# Altium schematic sheet NewChip.SchDoc
size Tabloid
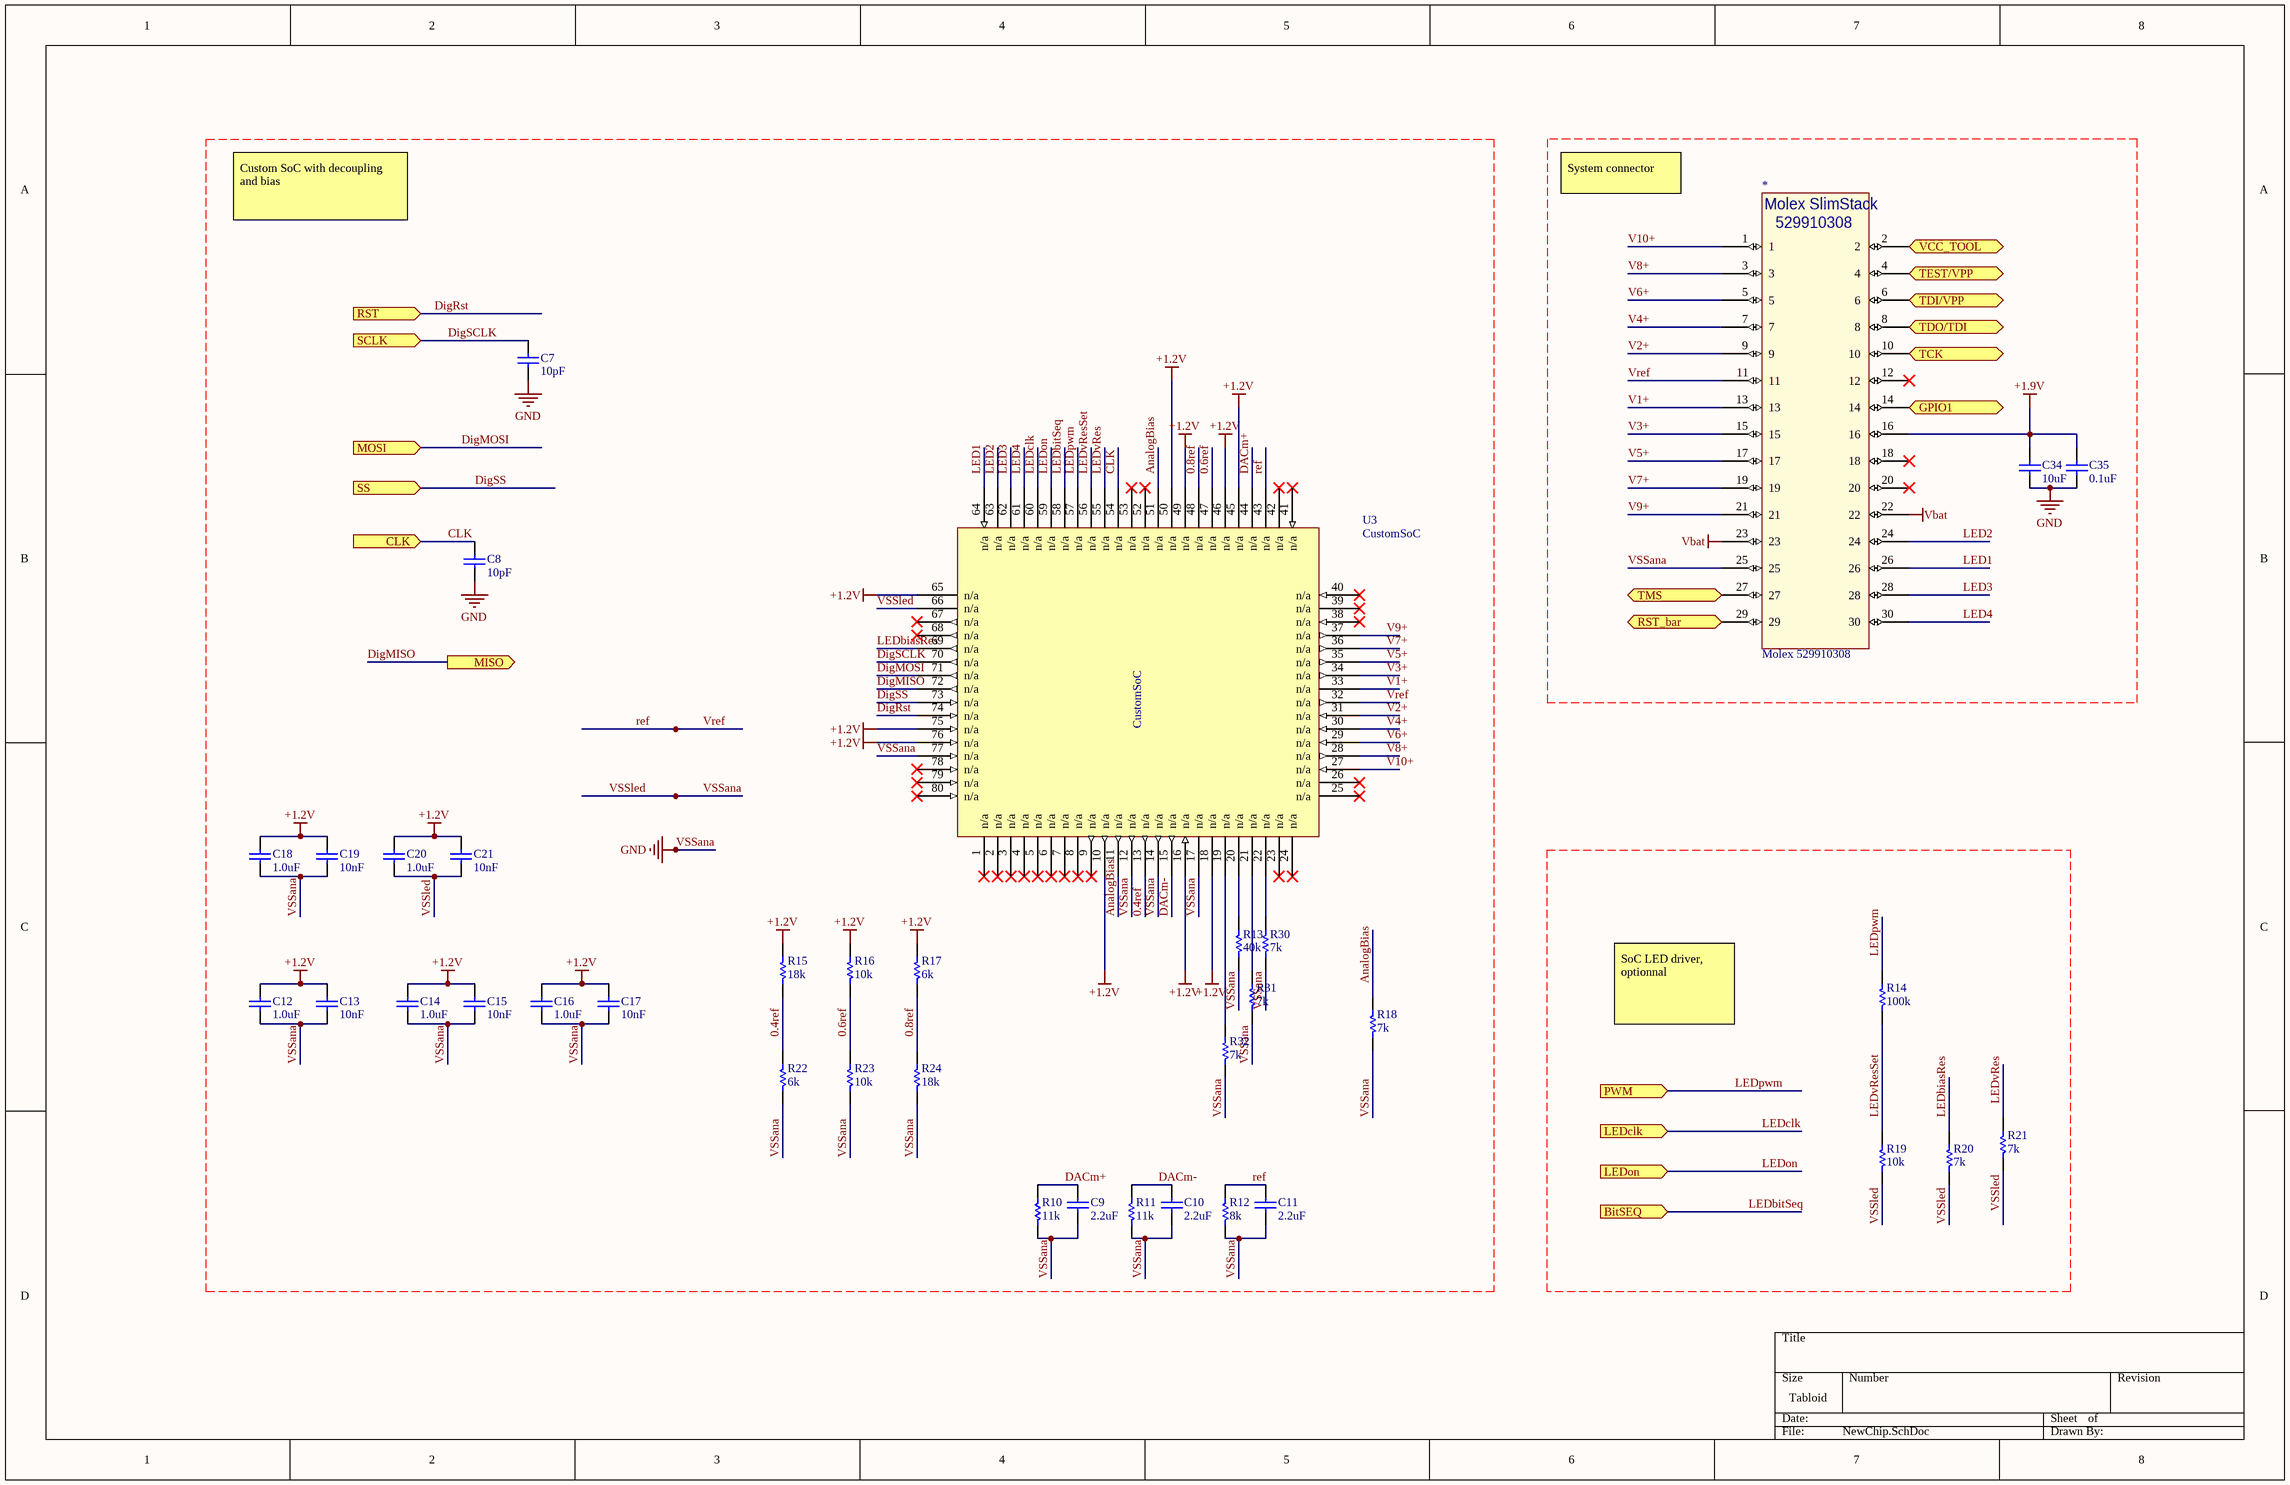
[diagram p0: NewChip.SchDoc]

## Parts
*  Molex 529910308  [Molex 0529910308]
C7  value 10pF  [0201_Custom]
C8  value 10pF  [0201_Custom]
C9  value 2.2uF  [0201_Custom]
C10  value 2.2uF  [0201_Custom]
C11  value 2.2uF  [0201_Custom]
C12  value 1.0uF  [0201_Custom]
C13  value 10nF  [0201_Custom]
C14  value 1.0uF  [0201_Custom]
C15  value 10nF  [0201_Custom]
C16  value 1.0uF  [0201_Custom]
C17  value 10nF  [0201_Custom]
C18  value 1.0uF  [0201_Custom]
C19  value 10nF  [0201_Custom]
C20  value 1.0uF  [0201_Custom]
C21  value 10nF  [0201_Custom]
C34  value 10uF  [0402]
C35  value 0.1uF  [0201_Custom]
R10  value 11k  [0201_Custom]
R11  value 11k  [0201_Custom]
R12  value 8k  [0201_Custom]
R13  value 40k  [0201_Custom]
R14  value 100k  [0201_Custom]
R15  value 18k  [0201_Custom]
R16  value 10k  [0201_Custom]
R17  value 6k  [0201_Custom]
R18  value 7k  [0201_Custom]
R19  value 10k  [0201_Custom]
R20  value 7k  [0201_Custom]
R21  value 7k  [0201_Custom]
R22  value 6k  [0201_Custom]
R23  value 10k  [0201_Custom]
R24  value 18k  [0201_Custom]
R30  value 7k  [0201_Custom]
R31  value 7k  [0201_Custom]
R32  value 7k  [0201_Custom]
U3  CustomSoC  [CustomSoC]

## Ports
BitSEQ (in), CLK (in), GPIO1 (bidir), LEDclk (in), LEDon (in), MISO (out), MOSI (in), PWM (in), RST (in), RST_bar (bidir), SCLK (in), SS (in), TCK (bidir), TDI/VPP (bidir), TDO/TDI (bidir), TEST/VPP (bidir), TMS (bidir), VCC_TOOL (bidir)

## Nets
+1.2V: C12.1 C13.1 C14.1 C15.1 C16.1 C17.1 C18.1 C19.1 C20.1 C21.1 R15.1 R16.1 R17.1 U3.10(n/a) U3.16(n/a) U3.18(n/a) U3.45(n/a) U3.46(n/a) U3.49(n/a) U3.50(n/a) U3.65(n/a) U3.75(n/a) U3.76(n/a)
+1.9V: *.16 C34.2 C35.2
Vbat: *.22 *.23
VSSana: *.25 C7.2 C8.2 C9.2 C10.2 C11.2 C12.2 C13.2 C14.2 C15.2 C16.2 C17.2 C18.2 C19.2 C20.2 C21.2 C34.1 C35.1 R10.2 R11.2 R12.2 R13.2 R18.2 R19.2 R20.2 R21.2 R22.2 R23.2 R24.2 R30.2 R31.2 R32.2 U3.12(n/a) U3.14(n/a) U3.17(n/a) U3.66(n/a) U3.77(n/a)  [also labelled GND, VSSled]
0.4ref: R15.2 R22.1 U3.13(n/a)
0.6ref: R16.2 R23.1 U3.47(n/a)
0.8ref: R17.2 R24.1 U3.48(n/a)
AnalogBias: R18.1 U3.11(n/a) U3.51(n/a)
CLK: C8.1 U3.54(n/a) ; port CLK
DACm+: C9.1 R10.1 U3.44(n/a)
DACm-: C10.1 R11.1 U3.15(n/a)
DigMISO: U3.72(n/a) ; port MISO
DigMOSI: U3.71(n/a) ; port MOSI
DigRst: U3.74(n/a) ; port RST
DigSCLK: C7.1 U3.70(n/a) ; port SCLK
DigSS: U3.73(n/a) ; port SS
GPIO1: *.14 ; port GPIO1
LED1: *.26 U3.64(n/a)
LED2: *.24 U3.63(n/a)
LED3: *.28 U3.62(n/a)
LED4: *.30 U3.61(n/a)
LEDbiasRes: R20.1 U3.69(n/a)
LEDbitSeq: U3.58(n/a) ; port BitSEQ
LEDclk: U3.60(n/a) ; port LEDclk
LEDon: U3.59(n/a) ; port LEDon
LEDpwm: R14.1 U3.57(n/a) ; port PWM
LEDvRes: R21.1 U3.55(n/a)
LEDvResSet: R14.2 R19.1 U3.56(n/a)
ref: *.11 C11.1 R12.1 U3.32(n/a) U3.43(n/a)  [also labelled Vref]
RST_bar: *.29 ; port RST_bar
TCK: *.10 ; port TCK
TDI/VPP: *.6 ; port TDI/VPP
TDO/TDI: *.8 ; port TDO/TDI
TEST/VPP: *.4 ; port TEST/VPP
TMS: *.27 ; port TMS
V1+: *.13 U3.33(n/a)
V2+: *.9 U3.31(n/a)
V3+: *.15 U3.34(n/a)
V4+: *.7 U3.30(n/a)
V5+: *.17 U3.35(n/a)
V6+: *.5 U3.29(n/a)
V7+: *.19 U3.36(n/a)
V8+: *.3 U3.28(n/a)
V9+: *.21 U3.37(n/a)
V10+: *.1 U3.27(n/a)
VCC_TOOL: *.2 ; port VCC_TOOL
NetR13_1: R13.1 U3.20(n/a)
NetR30_1: R30.1 U3.22(n/a)
NetR31_1: R31.1 U3.21(n/a)
NetR32_1: R32.1 U3.19(n/a)

Not connected (* = marked no-connect by the designer): * 12* 18* 20*; U3 1(n/a)* 2(n/a)* 3(n/a)* 4(n/a)* 5(n/a)* 6(n/a)* 7(n/a)* 8(n/a)* 9(n/a)* 23(n/a)* 24(n/a)* 25(n/a)* 26(n/a)* 38(n/a)* 39(n/a)* 40(n/a)* 41(n/a)* 42(n/a)* 52(n/a)* 53(n/a)* 67(n/a)* 68(n/a)* 78(n/a)* 79(n/a)* 80(n/a)*

## Notes on the sheet
- Custom SoC with decoupling and bias
- System connector
- SoC LED driver, optionnal
- (in symbol Molex 529910308) Molex SlimStack; 529910308

## Library data of the parts
C7-C21 C34 C35 = Cap Semi: Capacitor (Semiconductor SIM Model); Published: 8-Jun-2000; LatestRevisionDate: 29-May-2009; LatestRevisionNote: IPC-7351 Footprint Added.; PackageReference: C1206; Publisher: Altium Limited; PackageDescription: Chip Capacitor
R10-R24 R30-R32 = Res Semi: Semiconductor Resistor; Published: 8-Jun-2000; LatestRevisionDate: 17-Jul-2002; LatestRevisionNote: Re-released for DXP Platform.; PackageReference: AXIAL-0.5; Publisher: Altium Limited; PackageDescription: Axial Device, Thru-Hole; 2 Leads; 0.5 in Pin Spacing